# EAGLE design GearIndicator_pwr (EAGLE 7.1.0)
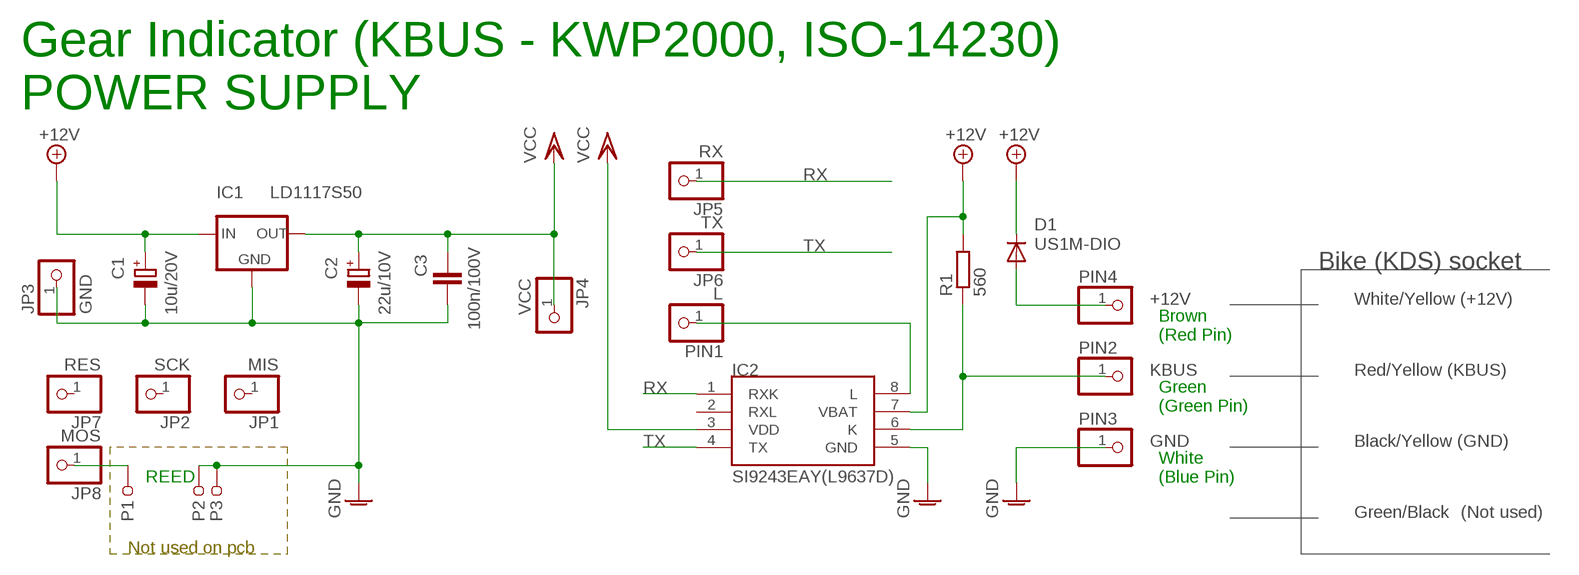
[diagram p0: schematic, sheet 1]

## Parts
C1  10u/20V  CPOL-EUCT3216  [CT3216]
C2  22u/10V  CPOL-EUCT3216  [CT3216]
C3  100n/100V  C-EUC1206  [C1206]
D1  US1M-DIO  DIODE-DO-214AC  [DO-214AC]
IC1  LD1117S50  AMS1117  [SOT223]
IC2  SI9243EAY(L9637D)  SI9243  [SO08]
JP1  MIS  PINHD-1X1  [1X01]
JP2  SCK  PINHD-1X1  [1X01]
JP3  GND  PINHD-1X1  [1X01]
JP4  VCC  PINHD-1X1  [1X01]
JP5  RX  PINHD-1X1  [1X01]
JP6  TX  PINHD-1X1  [1X01]
JP7  RES  PINHD-1X1  [1X01]
JP8  MOS  PINHD-1X1  [1X01]
P1  SMD2  [SMD_2X1]
P2  SMD2  [SMD_2X1]
P3  SMD2  [SMD_2X1]
PIN1  L  PIN1  [PIN1]
PIN2  KBUS  PIN1  [PIN1]
PIN3  GND  PIN1  [PIN1]
PIN4  +12V  PIN1  [PIN1]
R1  560  R-EU_R1206  [R1206]

## Nets
+12V: C1.+ D1.C IC1.3(IN) IC2.7(VBAT) R1.2
GND: C1.- C2.- C3.2 IC1.1(GND) IC2.5(GND) JP3.1 P2.P$1 P3.P$1 PIN3.1
N$1: D1.A PIN4.1
N$2: IC2.8(L) PIN1.1
N$3: IC2.6(K) PIN2.1 R1.1
N$4: JP8.1 P1.P$1
RX: IC2.1(RXK) JP5.1
TX: IC2.4(TX) JP6.1
VCC: C2.+ C3.1 IC1.2(OUT) IC2.3(VDD) JP4.1
Unconnected: IC2.2(RXL) JP1.1 JP2.1 JP7.1

## Notes on the sheet
- Gear Indicator (KBUS - KWP2000, ISO-14230)
  POWER SUPPLY
- Bike (KDS) socket
- White/Yellow (+12V)
- Brown
  (Red Pin)
- Red/Yellow (KBUS)
- Green
  (Green Pin)
- Black/Yellow (GND)
- REED
- White
  (Blue Pin)
- Green/Black | (Not used)
- Not used on pcb

## Library data of the parts
C1 C2 = rcl:CPOL-EU: POLARIZED CAPACITOR, European symbol
C3 = rcl:C-EU: CAPACITOR, European symbol
D1 = diode:DIODE-: DIODE
IC1 = v-reg:AMS1117
IC2 = smd-ipc:SI9243: The Si9243AEY is a monolithic bus transceiver designed to provide bidirectional serial communication in automotive diagnostic applications. The device incorporates protection against overvoltages and short circuits to VBAT. The transceiver pin is protected and can be driven beyond the VBAT voltage. The RX output is capable of driving CMOS or 1 x LSTTL load. The Si9243AEY is built on the Vishay Siliconix BiC/DMOS process. This process supports bipolar transistors, CMOS, and DMOS. An epitaxial layer prevents latchup. The Si9243AEY is available in a 8-pin SO package and operates over the automotive temperature range (- 40 °C to 125 °C). The Si9243AEY is available in both standard and lead (Pb)-free packages. FEATURES • Operating Power Supply Range 6 V <= VBAT<= 36 V • Reverse Battery Protection Down to VBAT >= - 24 V • Standby Mode With Very Low Current Consumption IBAT(SB) = 1 μA at VDD = 0.5 V • Low Quiescent Current in OFF Condition IBAT = 120 μA and IDD <= 10 A • ISO 9141 Compatible • Overtemperature Shutdown Function For K Output • Defined K Output OFF for Open GND • Defined Receive Output Status for Open K Input • Defined K Output OFF for TX Input Open • Open Drain Fault Output • 2 kV ESD • Typical Transmit Speeds of 200 kBaud
JP1-JP8 = pinhead:PINHD-1X1: PIN HEADER
P1-P3 = pinhead:SMD2
PIN1-PIN4 = pinhead:PIN1
R1 = rcl:R-EU_: RESISTOR, European symbol

## Board
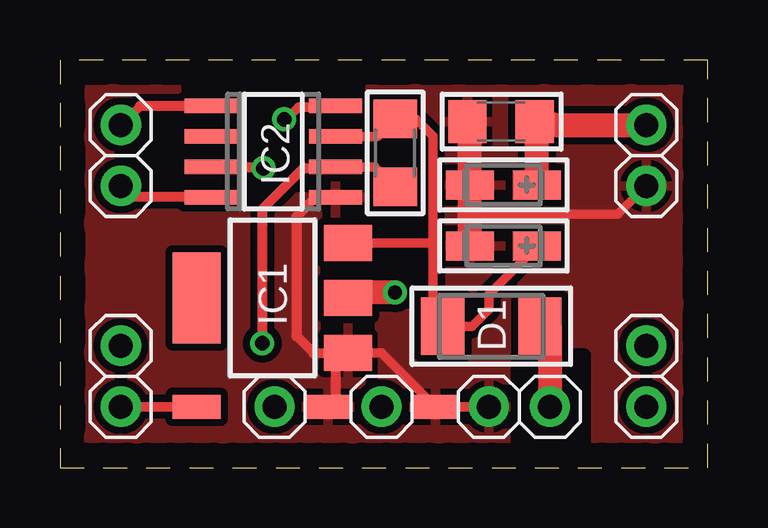
[diagram p1: board, top side]
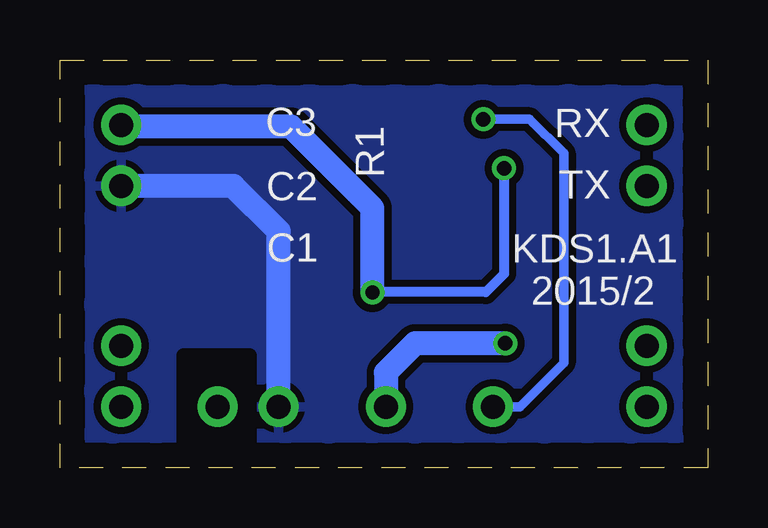
[diagram p2: board, bottom side, seen from below]

Size 27 x 17 mm. Coordinates in mm from the lower left corner, seen from the top.
Outline: 27,17 0,17 0,0 27,0 27,17
Copper layers (1*16): Top 0.035mm / dielectric 1.5mm / Bottom 0.035mm
Design rules "kawasaki": minimum track width 0.4mm, minimum drill 0.6mm, track to track 0.3mm, track to pad 0.3mm, pad to pad 0.3mm, via to via 0.3mm, smd to smd 0.3mm, copper to edge 40mil, drill to drill 8mil, minimum pad ring 10mil, minimum via ring 8mil, stop-mask expansion 4mil, vias tented up to drill 0mil, thermal gap 10mil
tRestrict: area 19.1,0.5 to 21.8,4.7
bRestrict: area 19.1,0.5 to 21.8,4.7

### Footprints (pad centres in the part's own frame; a part is rotated, then mirrored left to right if it is on the bottom)
CT3216 = smd 2 x 1.2: + -1.4,0; - 1.4,0
C1206 = smd 1.6 x 1.8: 1 -1.4,0; 2 1.4,0
DO-214AC = smd 1.8 x 2.4: A 2.025,0; C -2.025,0
SOT223 = smd 1.5 x 2: 1 -2.3,-3.15; 2 0,-3.15; 3 2.3,-3.15 | smd 3.8 x 2: 4 0,3.15
SO08 = smd 0.6 x 2.2: 1 -1.905,-2.6; 2 -0.635,-2.6; 3 0.635,-2.6; 4 1.905,-2.6; 5 1.905,2.6; 6 0.635,2.6; 7 -0.635,2.6; 8 -1.905,2.6
1X01 = drill 1 pad 1.676: 1 0,0
SMD_2X1 = smd 2 x 1: P$1 0,0
PIN1 = drill 1 pad 1.676: 1 0,0
R1206 = smd 1.6 x 1.803: 1 -1.422,0; 2 1.422,0

### Placement (x,y rotation side)
C1  18.49,9.25 180 top
C2  18.49,11.79 180 top
C3  18.39,14.43 180 top
D1  17.98,5.89 0 top
IC1  8.86,7.07 90 top
IC2  8.89,13.18 270 top
JP1  24.45,2.54 0 top
JP2  24.45,5.08 0 top
JP3  24.45,11.75 0 top
JP4  24.45,14.29 0 top
JP5  2.54,14.29 0 top
JP6  2.54,11.75 0 top
JP7  2.54,5.08 0 top
JP8  2.54,2.54 0 top
P1  5.69,2.54 0 top
P2  11.18,2.54 0 top
P3  15.65,2.54 0 top
PIN1  8.94,2.54 0 top
PIN2  13.41,2.54 0 top
PIN3  17.88,2.54 0 top
PIN4  20.43,2.54 0 top
R1  13.98,13.12 90 top

### Tracks (layer width: path | path; a pad name or v marks a point on that pad's centre or on a via)
+12V
  Top 0.4: 12.06,9.21 IC1.3 15.54,9.37 | 20.32,8.89 C1.+ 19.89,9.22 17.88,7.21 17.88,6.6 17.17,5.89 D1.C 15.54,6.41 15.54,9.37 | IC2.7 13.24,13.81 R1.2 13.99,14.53 14.83,14.53 15.54,13.82 15.54,9.37
  Top 0.406: 20.32,8.89 20.32,8.84
GND
  Top 0.4: 17.78,11.75 C2.- 17.78,11.43 | 17.09,14.33 C3.2 | C1.- 17.09,10.39 17.27,10.57 23.27,10.57 JP3.1 | PIN3.1 P3.P$1 13.41,4.77 IC1.1 11.5,4.77 11.5,4.78
  Top 0.406: IC2.5 10.66,11.27 9.86,10.46 9.86,5.49 10.57,4.78 11.5,4.78 11.5,2.55 P2.P$1
  Top 1: 17.09,14.33 C2.- C1.-
  Bottom 1: PIN3.1 17.88,9.86 19.77,11.75 JP3.1
  pour Top (isolate 0.3): 0.51,16.46 26.42,16.46 26.42,0.51 0.51,0.51
  pour Bottom (isolate 0.3): 0.51,16.46 26.42,16.46 26.42,0.51 0.51,0.51
N$1
  Top 0.406: D1.A 20.43,5.8
  Top 1: 20.43,5.8 PIN4.1
N$2  (via drill 0.6)
  Top 0.4: v9.35,14.53 9.45,14.53 9.96,15.04 11.45,15.04 IC2.8
  Bottom 0.4: v9.35,14.53 7.42,14.53 5.99,13.11 5.99,4.37 7.82,2.54 PIN1.1
N$3  (via drill 0.6)
  Top 0.4: 11.45,12.5 IC2.6 13.14,12.54 R1.1
  Top 0.406: v8.43,5.18 8.43,10.77 10.16,12.5 11.45,12.5
  Bottom 1: v8.43,5.18 12.19,5.18 13.41,3.96 PIN2.1
N$4
  Top 0.4: P1.P$1 JP8.1
RX
  Top 0.4: 3.33,15.08 JP5.1
  Top 0.406: IC2.1 3.33,15.08
TX
  Top 0.4: 3.02,11.27 JP6.1
  Top 0.406: IC2.4 3.02,11.27
VCC  (via drill 0.6)
  Top 0.4: 20.64,14.29 C3.1 | 12.06,7.3 IC1.2 | 20.64,14.61 C3.1 | 19.89,14.33 C3.1
  Top 0.406: IC2.3 8.43,12.54 v8.48,12.48
  Top 1: v13.97,7.3 12.06,7.3 | 20.64,14.29 JP4.1 | C2.+ 19.89,14.33
  Bottom 0.406: v8.48,12.48 8.48,8.08 9.25,7.32 13.96,7.32 v13.97,7.3 | 24.38,14.22 JP4.1
  Bottom 1: v13.97,7.3 13.97,10.82 17.37,14.22 24.38,14.22

### Text on the board
bNames: KDS1.A1 | 2015/2